# Altium schematic sheet comms_uhf.SchDoc
size A4; SheetNumber: 2; SheetTotal: 5
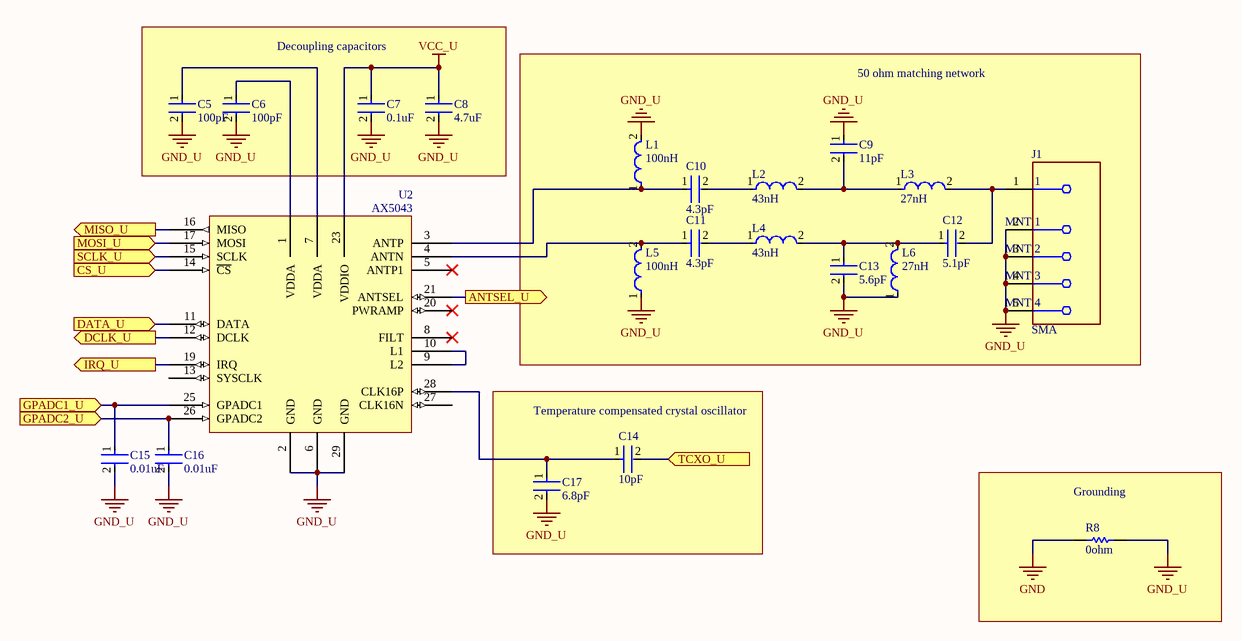
[diagram p0: comms_uhf.SchDoc]

## Parts
C5  100pF  [FP-C0805C-DN-IPC_A]
C6  100pF  [FP-C0805C-DN-IPC_A]
C7  0.1uF  [FP-C0805C-DN-IPC_A]
C8  4.7uF  [FP-C0805C-DN-IPC_A]
C9  11pF  [FP-C0805C-DN-IPC_A]
C10  4.3pF  [FP-C0805C-DN-IPC_A]
C11  4.3pF  [FP-C0805C-DN-IPC_A]
C12  5.1pF  [FP-C0805C-DN-IPC_A]
C13  5.6pF  [FP-C0805C-DN-IPC_A]
C14  10pF  [FP-C0805C-DN-IPC_A]
C15  0.01uF  [FP-C0805C-DN-IPC_A]
C16  0.01uF  [FP-C0805C-DN-IPC_A]
C17  6.8pF  [FP-C0805C-DN-IPC_A]
J1  SMA  [FP-73251-1350-MFG]
L1  100nH  [FP-C0805C-DN-IPC_A]
L2  43nH  [FP-C0805C-DN-IPC_A]
L3  27nH  [FP-C0805C-DN-IPC_A]
L4  43nH  [FP-C0805C-DN-IPC_A]
L5  100nH  [FP-C0805C-DN-IPC_A]
L6  27nH  [FP-C0805C-DN-IPC_A]
R8  0ohm  [FP-C0805C-DN-IPC_A]
U2  AX5043  [QFN50P500X500X90_HS-29N]

## Blocks framed on the sheet
Decoupling capacitors: C5-C8
50 ohm matching network: C9-C13 J1 L1-L6
Temperature compensated crystal oscillator: C14 C17
Grounding: R8

## Ports
ANTSEL_U (out), CS_U (in), DATA_U (in), DCLK_U (out), GPADC1_U (in), GPADC2_U (in), IRQ_U (out), MISO_U (out), MOSI_U (in), SCLK_U (in), TCXO_U (in)

## Nets
GND: R8.1
GND_U: C5.2 C6.2 C7.2 C8.2 C9.1 C13.2 C15.2 C16.2 C17.2 J1.2(MNT_1) J1.3(MNT_2) J1.4(MNT_3) J1.5(MNT_4) L1.2 L5.1 L6.1 R8.2 U2.2(GND) U2.6(GND) U2.29(GND)
VCC_U: C7.1 C8.1 U2.23(VDDIO)
ANTSEL_U: U2.21(ANTSEL) ; port ANTSEL_U
CS_U: U2.14(~{CS}) ; port CS_U
DATA_U: U2.11(DATA) ; port DATA_U
DCLK_U: U2.12(DCLK) ; port DCLK_U
GPADC1_U: C15.1 U2.25(GPADC1) ; port GPADC1_U
GPADC2_U: C16.1 U2.26(GPADC2) ; port GPADC2_U
IRQ_U: U2.19(IRQ) ; port IRQ_U
MISO_U: U2.16(MISO) ; port MISO_U
MOSI_U: U2.17(MOSI) ; port MOSI_U
SCLK_U: U2.15(SCLK) ; port SCLK_U
TCXO_U: C14.2 ; port TCXO_U
NetC5_1: C5.1 U2.7(VDDA)
NetC6_1: C6.1 U2.1(VDDA)
NetC9_2: C9.2 L2.2 L3.1
NetC10_1: C10.1 L1.1 U2.3(ANTP)
NetC10_2: C10.2 L2.1
NetC11_1: C11.1 L5.2 U2.4(ANTN)
NetC11_2: C11.2 L4.1
NetC12_1: C12.1 C13.1 L4.2 L6.2
NetC12_2: C12.2 J1.1 L3.2
NetC14_1: C14.1 C17.1 U2.28(CLK16P)
NetU2_9: U2.9(L2) U2.10(L1)

Not connected (* = marked no-connect by the designer): U2 5(ANTP1)* 8(FILT)* 13(SYSCLK) 20(PWRAMP)* 27(CLK16N)

## Library data of the parts
C5 C6 = C0805C101J1GACTU: Multilayer Ceramic Capacitors (MLCC) - SMD/SMT 100volts 100pF C0G 5%; Manufacturer: KEMET; Voltage Rating: 100V; Temperature Coefficient: 30ppm/°C; Dissipation Factor: 0.1%; Supplier 1: Digi-Key; Manufacturer Part Number: C0805C101J1GACTU; RoHS: Yes; Category: Ceramic Capacitors; Stock 1: 41207; Pricing 1: 1=0.11000, 10=0.07900, 50=0.04500, 100=0.03730, 500=0.02616, 1000=0.02166 (USD); Mount: Surface Mount,PCB; Case/Package: 0805; Number of Pins: 2; Case Code (Imperial): 0805; Case Code (Metric): 2012; Contact Plating: Tin,Matte; Dielectric Material: Ceramic; Contact Material: Tin; Min Operating Temperature: -55°C; Max Operating Temperature: 125°C; Capacitance: 100pF; Tolerance: 5%; Voltage Rating (DC): 100V; Packaging: Tape and Reel; Dielectric: C0G; Series: C; Package Quantity: 1; Termination: SMD/SMT; Voltage: 100V; Construction: Flat; Length: 2mm; Width: 1.2mm; Height: 0.78mm; Thickness: 0.035inch; Depth: 1.25mm; Lead Pitch: 0.75mm; Radiation Hardening: No; Lead Free: Lead Free; RoHS Compliant: Yes; REACH SVHC: No SVHC; ComponentLink1URL: https://datasheet.ciiva.com/144/docfinderpartnumber-c0805c101j1gactu-144890.pdf?src-supplier=Digi-Key; ComponentLink1Description: https://datasheet.ciiva.com/144/docfinderpartnumber-c0805c101j1gactu-144890.pdf?src-supplier=Digi-Key; ComponentLink2URL: https://datasheet.ciiva.com/6126/f9080b-0402-series-c0g-6126695.pdf?src-supplier=Farnell; ComponentLink2Description: https://datasheet.ciiva.com/6126/f9080b-0402-series-c0g-6126695.pdf?src-supplier=Farnell; ComponentLink3URL: https://datasheet.ciiva.com/2988/kem-c1003-c0g-smd-2988557.pdf?src-supplier=Avnet; ComponentLink3Description: https://datasheet.ciiva.com/2988/kem-c1003-c0g-smd-2988557.pdf?src-supplier=Avnet; ComponentLink4URL: https://datasheet.ciiva.com/2988/kem-c1003-c0g-smd-2988558.pdf?src-supplier=Avnet; ComponentLink4Description: https://datasheet.ciiva.com/2988/kem-c1003-c0g-smd-2988558.pdf?src-supplier=Avnet; ComponentLink5URL: https://datasheet.ciiva.com/14589/70095383-14589484.pdf?src-supplier=Allied+Electronics; ComponentLink5Description: https://datasheet.ciiva.com/14589/70095383-14589484.pdf?src-supplier=Allied+Electronics; ComponentLink6URL: https://datasheet.ciiva.com/14591/70095383-14591851.pdf?src-supplier=Allied+Electronics; ComponentLink6Description: https://datasheet.ciiva.com/14591/70095383-14591851.pdf?src-supplier=Allied+Electronics; ComponentLink7URL: https://datasheet.ciiva.com/7842/40889-7842143.pdf?src-supplier=Element14; ComponentLink7Description: https://datasheet.ciiva.com/7842/40889-7842143.pdf?src-supplier=Element14; ComponentLink8URL: https://datasheet.ciiva.com/28688/1789732-28688663.pdf?src-supplier=Element14; ComponentLink8Description: https://datasheet.ciiva.com/28688/1789732-28688663.pdf?src-supplier=Element14; ComponentLink9URL: https://datasheet.ciiva.com/18193/getdatasheetpartid-93983-18193285.pdf?src-supplier=Verical; ComponentLink9Description: https://datasheet.ciiva.com/18193/getdatasheetpartid-93983-18193285.pdf?src-supplier=Verical; ComponentLink10URL: https://datasheet.ciiva.com/7405/1372242-7405224.pdf?src-supplier=Newark; ComponentLink10Description: https://datasheet.ciiva.com/7405/1372242-7405224.pdf?src-supplier=Newark; Supplier Part Number 1: 399-C0805C101J1GAC7800CT-ND
C7 = C0805C104K5RACTU: Cap Ceramic 0.1uF 50V X7R 10% SMD 2.0 x 1.2 mm 125 C Paper T/R; Manufacturer: KEMET; Capacitance: 100nF; Voltage: 500V; Supplier 1: Digi-Key; Manufacturer Part Number: C0805C104K5RACTU; RoHS: Yes; Category: Ceramic Capacitors; Pricing 1: 1=0.15000, 10=0.10500, 50=0.05960, 100=0.04940, 500=0.03466, 1000=0.02869 (USD); Mount: Surface Mount,PCB; Case/Package: 0805; Number of Pins: 2; Case Code (Imperial): 0805; Case Code (Metric): 2012; Dielectric Material: Ceramic; Contact Plating: Tin,Matte; Min Operating Temperature: -55°C; Max Operating Temperature: 125°C; Package Quantity: 4000; Voltage Rating: 50V; Tolerance: 10%; Packaging: Tape and Reel; Dielectric: X7R; Termination: SMD/SMT; Voltage Rating (DC): 50V; Series: C0805C; Construction: Flat; Length: 2mm; Width: 1.2mm; Height: 0.9mm; Thickness: 0.035inch; Depth: 1.25mm; Lead Pitch: 0.75mm; Radiation Hardening: No; REACH SVHC: No SVHC; RoHS Compliant: Yes; ComponentLink1URL: https://www.distrelec.biz/Web/Downloads/_t/ds/KEM_C1002_X7R_SMD_eng_tds.pdf?mime=application%2Fpdf&src-supplier=Distrelec; ComponentLink1Description: https://www.distrelec.biz/Web/Downloads/_t/ds/KEM_C1002_X7R_SMD_eng_tds.pdf?mime=application%2Fpdf&src-supplier=Distrelec; ComponentLink2URL: http://www.farnell.com/datasheets/2740684.pdf?src-supplier=Farnell; ComponentLink2Description: http://www.farnell.com/datasheets/2740684.pdf?src-supplier=Farnell; ComponentLink3URL: http://www.farnell.com/datasheets/2740684.pdf?src-supplier=Element14; ComponentLink3Description: http://www.farnell.com/datasheets/2740684.pdf?src-supplier=Element14; Supplier Part Number 1: 399-C0805C104K5RAC7800CT-ND; Stock 1: 2034176
C8 = C0805C475K3PACTU: Cap Ceramic 4.7uF 25V X5R 10% SMD 0805 85°C Plastic T/R; Manufacturer: KEMET; Dissipation Factor: 5%; Supplier 1: Digi-Key; Manufacturer Part Number: C0805C475K3PACTU; RoHS: Yes; Category: Ceramic Capacitors; Pricing 1: 1=0.36000, 10=0.24800, 50=0.16500, 100=0.14020, 500=0.09900, 1000=0.08662 (USD); Mount: PCB,Surface Mount; Case/Package: 0805; Number of Pins: 2; Case Code (Imperial): 0805; Case Code (Metric): 2012; Dielectric Material: Ceramic; Contact Plating: Tin,Matte; Min Operating Temperature: -55°C; Max Operating Temperature: 85°C; Capacitance: 4.7uF; Tolerance: 10%; Packaging: Tape and Reel; Dielectric: X5R; Package Quantity: 2500; Series: C0805C; Termination: SMD/SMT; Voltage Rating (DC): 25V; Construction: Flat; Voltage: 25V; Length: 2mm; Width: 1.2mm; Height: 1.25mm; Depth: 1.25mm; Radiation Hardening: No; RoHS Compliant: Yes; Lead Free: Lead Free; REACH SVHC: No SVHC; ComponentLink1URL: https://datasheet.ciiva.com/3776/c0603c102k5racturegion-naregion-na-3776917.pdf?src-supplier=Arrow+Electronics; ComponentLink1Description: https://datasheet.ciiva.com/3776/c0603c102k5racturegion-naregion-na-3776917.pdf?src-supplier=Arrow+Electronics; ComponentLink2URL: https://datasheet.ciiva.com/18193/getdatasheetpartid-385757-18193895.pdf?src-supplier=Verical; ComponentLink2Description: https://datasheet.ciiva.com/18193/getdatasheetpartid-385757-18193895.pdf?src-supplier=Verical; ComponentLink3URL: https://datasheet.ciiva.com/18193/getdatasheetpartid-195812-18193898.pdf?src-supplier=Verical; ComponentLink3Description: https://datasheet.ciiva.com/18193/getdatasheetpartid-195812-18193898.pdf?src-supplier=Verical; ComponentLink4URL: https://datasheet.ciiva.com/7842/40889-7842614.pdf?src-supplier=Element14; ComponentLink4Description: https://datasheet.ciiva.com/7842/40889-7842614.pdf?src-supplier=Element14; ComponentLink5URL: https://datasheet.ciiva.com/22748/1918694-22748309.pdf?src-supplier=Element14; ComponentLink5Description: https://datasheet.ciiva.com/22748/1918694-22748309.pdf?src-supplier=Element14; Supplier Part Number 1: 399-C0805C475K3PAC7800CT-ND; Stock 1: 10860
C9 = C0805C110J5GACTU: Cap Ceramic 11pF 50V C0G 5% SMD 0805 125°C Plastic T/R; Manufacturer: KEMET; Dissipation Factor: 0.1%; Supplier 1: Digi-Key; Manufacturer Part Number: C0805C110J5GACTU; RoHS: Yes; Category: Ceramic Capacitors; Mount: Surface Mount; Case/Package: 0805; Case Code (Metric): 2012; Case Code (Imperial): 0805; Dielectric Material: Ceramic; Min Operating Temperature: -55°C; Max Operating Temperature: 125°C; Package Quantity: 1; Capacitance: 11pF; Tolerance: 5%; Packaging: Tape and Reel; Voltage Rating: 50V; Series: C; Voltage Rating (DC): 50V; Termination: SMD/SMT; Dielectric: C0G; Length: 0.079inch; Width: 0.049inch; Height: 0.78mm; Thickness: 0.035inch; Lead Pitch: 0.75mm; RoHS Compliant: Yes; Lead Free: Lead Free; ComponentLink1URL: https://datasheet.ciiva.com/5424/kem-c1003-c0g-smd-356956-5424409.pdf?src-supplier=Mouser; ComponentLink1Description: https://datasheet.ciiva.com/5424/kem-c1003-c0g-smd-356956-5424409.pdf?src-supplier=Mouser; Supplier Part Number 1: 399-9164-1-ND
C10 C11 = C0805C439D1GACTU: Cap Ceramic 4.3pF 100V C0G 0.5pF SMD 0805 125°C Paper T/R; Manufacturer: KEMET; Supplier 1: Digi-Key; Manufacturer Part Number: C0805C439D1GACTU; RoHS: Yes; Category: Ceramic Capacitors; Mount: Surface Mount; Case/Package: 0805; Case Code (Metric): 2012; Case Code (Imperial): 0805; Weight: 0.000194oz; Dielectric Material: Ceramic; Min Operating Temperature: -55°C; Max Operating Temperature: 125°C; Capacitance: 4.3pF; Package Quantity: 4000; Packaging: Tape and Reel; Voltage Rating (DC): 100V; Dielectric: C0G; Termination: SMD/SMT; Voltage Rating: 100V; Series: C; Length: 2mm; Width: 0.049inch; Height: 0.78mm; Thickness: 0.035inch; Depth: 1.25mm; RoHS Compliant: Yes; Lead Free: Lead Free; ComponentLink1URL: https://datasheet.ciiva.com/5440/kem-c1003-c0g-smd-356956-5440447.pdf?src-supplier=Mouser; ComponentLink1Description: https://datasheet.ciiva.com/5440/kem-c1003-c0g-smd-356956-5440447.pdf?src-supplier=Mouser; Supplier Part Number 1: C0805C439D1GACTU-ND
C12 = C0805C519C5GACTU: Cap Ceramic 5.1pF 50V C0G 0.25pF SMD 0805 125°C Paper T/R; Manufacturer: KEMET; Dissipation Factor: 0.1%; Supplier 1: Digi-Key; Manufacturer Part Number: C0805C519C5GACTU; RoHS: Yes; Category: Ceramic Capacitors; Pricing 1: 4000=0.11781 (USD); Mount: Surface Mount; Case/Package: 0805; Case Code (Imperial): 0805; Case Code (Metric): 2012; Dielectric Material: Ceramic; Min Operating Temperature: -55°C; Max Operating Temperature: 125°C; Capacitance: 5.1pF; Voltage Rating (DC): 50V; Packaging: Tape and Reel; Dielectric: C0G; Package Quantity: 4000; Termination: SMD/SMT; Voltage Rating: 50V; Series: C0805C; Length: 0.079inch; Width: 1.2mm; Thickness: 0.035inch; RoHS Compliant: Yes; Lead Free: Lead Free; REACH SVHC: No SVHC; ComponentLink1URL: http://www.farnell.com/datasheets/2112203.pdf?src-supplier=Farnell; ComponentLink1Description: http://www.farnell.com/datasheets/2112203.pdf?src-supplier=Farnell; ComponentLink2URL: http://www.mouser.com/ds/2/212/KEM_C1003_C0G_SMD-1101588.pdf?src-supplier=Mouser; ComponentLink2Description: http://www.mouser.com/ds/2/212/KEM_C1003_C0G_SMD-1101588.pdf?src-supplier=Mouser; ComponentLink3URL: https://search.kemet.com/component-edge/download/datasheet/C0805C519C5GACTU.pdf?src-supplier=Digi-Key; ComponentLink3Description: https://search.kemet.com/component-edge/download/datasheet/C0805C519C5GACTU.pdf?src-supplier=Digi-Key; ComponentLink4URL: http://www.farnell.com/datasheets/2112203.pdf?src-supplier=Element14; ComponentLink4Description: http://www.farnell.com/datasheets/2112203.pdf?src-supplier=Element14; Supplier Part Number 1: 399-C0805C519C5GAC7800TR-ND
C13 = C0805C569D5GACTU: Cap Ceramic 5.6pF 50V C0G 0.5pF SMD 0805 125°C Plastic T/R; Manufacturer: KEMET; Dissipation Factor: 0.5%; Supplier 1: Digi-Key; Manufacturer Part Number: C0805C569D5GACTU; RoHS: Yes; Category: Ceramic Capacitors; Stock 1: 16697; Pricing 1: 1=0.24000, 10=0.16500, 50=0.11000, 100=0.09350, 500=0.06600, 1000=0.05775 (USD); Mount: Surface Mount; Case/Package: 0805; Case Code (Metric): 2012; Case Code (Imperial): 0805; Dielectric Material: Ceramic; Contact Material: Tin; Min Operating Temperature: -55°C; Max Operating Temperature: 125°C; Capacitance: 5.6pF; Packaging: Tape and Reel; Dielectric: C0G; Package Quantity: 1; Voltage Rating (DC): 50V; Termination: SMD/SMT; Voltage Rating: 50V; Series: C; Length: 2mm; Width: 0.049inch; Height: 0.78mm; Thickness: 0.035inch; Depth: 1.25mm; Lead Pitch: 0.75mm; RoHS Compliant: Yes; Lead Free: Lead Free; REACH SVHC: No SVHC; ComponentLink1URL: https://www.distrelec.biz/Web/Downloads/_t/ds/KEM_C1003_C0G_SMD_eng_tds.pdf?mime=application%2Fpdf&src-supplier=Distrelec; ComponentLink1Description: https://www.distrelec.biz/Web/Downloads/_t/ds/KEM_C1003_C0G_SMD_eng_tds.pdf?mime=application%2Fpdf&src-supplier=Distrelec; ComponentLink2URL: http://www.mouser.com/ds/2/212/KEM_C1003_C0G_SMD-1101588.pdf?src-supplier=Mouser; ComponentLink2Description: http://www.mouser.com/ds/2/212/KEM_C1003_C0G_SMD-1101588.pdf?src-supplier=Mouser; ComponentLink3URL: https://api.kemet.com/component-edge/download/datasheet/C0805C569D5GACTU.pdf?src-supplier=Digi-Key; ComponentLink3Description: https://api.kemet.com/component-edge/download/datasheet/C0805C569D5GACTU.pdf?src-supplier=Digi-Key; ComponentLink4URL: https://search.kemet.com/component-edge/download/datasheet/C0805C569D5GACTU.pdf?src-supplier=Digi-Key; ComponentLink4Description: https://search.kemet.com/component-edge/download/datasheet/C0805C569D5GACTU.pdf?src-supplier=Digi-Key; Supplier Part Number 1: 399-C0805C569D5GAC7800CT-ND
C14 = C0805C100J1GACTU: Cap Ceramic 10pF 100V C0G 5% SMD 0805 125C Plastic T/R; Manufacturer: KEMET; Dissipation Factor: 0.1%; Temperature Coefficient: 30ppm/°C; Supplier 1: Digi-Key; Manufacturer Part Number: C0805C100J1GACTU; RoHS: Yes; Category: Ceramic Capacitors; Stock 1: 26087; Pricing 1: 1=0.20000, 10=0.14000, 50=0.07960, 100=0.06600, 500=0.04630, 1000=0.03833 (USD); Mount: Surface Mount,PCB; Case/Package: 0805; Number of Pins: 2; Case Code (Metric): 2012; Case Code (Imperial): 0805; Dielectric Material: Ceramic; Weight: 0.000194oz; Contact Material: Tin; Min Operating Temperature: -55°C; Max Operating Temperature: 125°C; Capacitance: 10pF; Packaging: Tape and Reel; Voltage Rating: 100V; Voltage Rating (DC): 100V; Package Quantity: 1; Dielectric: C0G; Termination: SMD/SMT; Tolerance: 5%; Series: C; Construction: Flat; Voltage: 100V; Length: 2mm; Width: 0.049inch; Height: 0.78mm; Thickness: 0.035inch; Depth: 1.25mm; Radiation Hardening: No; REACH SVHC: No SVHC; RoHS Compliant: Yes; Lead Free: Lead Free; ComponentLink1URL: https://datasheet.ciiva.com/7842/kem-c1003-c0g-smd-7842137.pdf?src-supplier=Element14; ComponentLink1Description: https://datasheet.ciiva.com/7842/kem-c1003-c0g-smd-7842137.pdf?src-supplier=Element14; ComponentLink2URL: https://datasheet.ciiva.com/7842/kem-c1003-c0g-smd-7842136.pdf?src-supplier=Element14; ComponentLink2Description: https://datasheet.ciiva.com/7842/kem-c1003-c0g-smd-7842136.pdf?src-supplier=Element14; ComponentLink3URL: https://datasheet.ciiva.com/28668/1789732-28668725.pdf?src-supplier=Element14; ComponentLink3Description: https://datasheet.ciiva.com/28668/1789732-28668725.pdf?src-supplier=Element14; ComponentLink4URL: https://datasheet.ciiva.com/14588/70095383-14588189.pdf?src-supplier=Allied+Electronics; ComponentLink4Description: https://datasheet.ciiva.com/14588/70095383-14588189.pdf?src-supplier=Allied+Electronics; ComponentLink5URL: https://datasheet.ciiva.com/14603/70095383-14603133.pdf?src-supplier=Allied+Electronics; ComponentLink5Description: https://datasheet.ciiva.com/14603/70095383-14603133.pdf?src-supplier=Allied+Electronics; Supplier Part Number 1: 399-C0805C100J1GAC7800CT-ND
C15 C16 = C0805C103K5RAC-TU: Cap Ceramic 0.01uF 50V X7R 10% SMD 0805 125C Plastic T/R; Manufacturer: KEMET; Capacitance: 10nF; Supplier 1: RSComponents; Manufacturer Part Number: C0805C103K5RAC-TU; RoHS: Yes; Category: Ceramic Capacitors; Stock 1: 8800; Pricing 1: 25=0.14500, 100=0.13600, 250=0.12500, 500=0.11800, 1250=0.10800 (USD); Mount: PCB,Surface Mount; Case/Package: 0805; Number of Pins: 2; Case Code (Metric): 2012; Case Code (Imperial): 0805; Dielectric Material: Ceramic; Min Operating Temperature: -55°C; Max Operating Temperature: 125°C; Voltage Rating (DC): 50V; Tolerance: 10%; Voltage Rating: 50V; Packaging: Tape and Reel; Package Quantity: 4000; Dielectric: X7R; Termination: SMD/SMT; Voltage: 50V; Series: C0805C; Construction: Flat; Length: 2mm; Width: 1.2mm; Height: 0.78mm; Thickness: 0.035inch; Depth: 1.25mm; Lead Pitch: 0.75mm; Radiation Hardening: No; REACH SVHC: No SVHC; ComponentLink1URL: https://datasheet.ciiva.com/7172/1828800-7172412.pdf?src-supplier=Newark; ComponentLink1Description: https://datasheet.ciiva.com/7172/1828800-7172412.pdf?src-supplier=Newark; ComponentLink2URL: https://datasheet.ciiva.com/5904/kem-c1002-x7r-smd-5904709.pdf?src-supplier=Farnell; ComponentLink2Description: https://datasheet.ciiva.com/5904/kem-c1002-x7r-smd-5904709.pdf?src-supplier=Farnell; ComponentLink3URL: https://datasheet.ciiva.com/7842/kem-c1002-x7r-smd-7842533.pdf?src-supplier=Element14; ComponentLink3Description: https://datasheet.ciiva.com/7842/kem-c1002-x7r-smd-7842533.pdf?src-supplier=Element14; ComponentLink4URL: https://datasheet.ciiva.com/28672/1851736-28672830.pdf?src-supplier=Element14; ComponentLink4Description: https://datasheet.ciiva.com/28672/1851736-28672830.pdf?src-supplier=Element14; ComponentLink5URL: https://datasheet.ciiva.com/26923/getdatasheetpartid-759674-26923957.pdf?src-supplier=Verical; ComponentLink5Description: https://datasheet.ciiva.com/26923/getdatasheetpartid-759674-26923957.pdf?src-supplier=Verical; ComponentLink6URL: https://datasheet.ciiva.com/39122/docfinderpartnumberc0402c102k5ractu-39122923.pdf?src-supplier=Onlinecomponents.com; ComponentLink6Description: https://datasheet.ciiva.com/39122/docfinderpartnumberc0402c102k5ractu-39122923.pdf?src-supplier=Onlinecomponents.com; Supplier Part Number 1: 2644371
C17 = C0805C689D5GACTU: Cap Ceramic 6.8pF 50V C0G 0.5pF SMD 0805 125°C Plastic T/R; Manufacturer: KEMET; Dissipation Factor: 0.1%; Supplier 1: Digi-Key; Manufacturer Part Number: C0805C689D5GACTU; RoHS: Yes; Category: Ceramic Capacitors; Stock 1: 43898; Pricing 1: 1=0.24000, 10=0.16500, 50=0.11000, 100=0.09350, 500=0.06600, 1000=0.05775 (USD); Mount: Surface Mount; Case/Package: 0805; Case Code (Metric): 2012; Case Code (Imperial): 0805; Dielectric Material: Ceramic; Contact Material: Tin; Min Operating Temperature: -55°C; Max Operating Temperature: 125°C; Package Quantity: 1; Capacitance: 6.8pF; Voltage Rating: 50V; Packaging: Tape and Reel; Voltage Rating (DC): 50V; Termination: SMD/SMT; Series: C; Dielectric: C0G; Construction: Flat; Length: 2mm; Width: 0.049inch; Height: 0.78mm; Thickness: 0.035inch; Depth: 1.25mm; Lead Pitch: 0.75mm; Radiation Hardening: No; RoHS Compliant: Yes; Lead Free: Lead Free; REACH SVHC: No SVHC; ComponentLink1URL: https://www.distrelec.biz/Web/Downloads/_t/ds/KEM_C1003_C0G_SMD_eng_tds.pdf?mime=application%2Fpdf&src-supplier=Distrelec; ComponentLink1Description: https://www.distrelec.biz/Web/Downloads/_t/ds/KEM_C1003_C0G_SMD_eng_tds.pdf?mime=application%2Fpdf&src-supplier=Distrelec; ComponentLink2URL: http://www.farnell.com/datasheets/2330629.pdf?src-supplier=Farnell; ComponentLink2Description: http://www.farnell.com/datasheets/2330629.pdf?src-supplier=Farnell; ComponentLink3URL: http://www.mouser.com/ds/2/212/KEM_C1003_C0G_SMD-1101588.pdf?src-supplier=Mouser; ComponentLink3Description: http://www.mouser.com/ds/2/212/KEM_C1003_C0G_SMD-1101588.pdf?src-supplier=Mouser; ComponentLink4URL: http://www.farnell.com/datasheets/2330629.pdf?src-supplier=Newark; ComponentLink4Description: http://www.farnell.com/datasheets/2330629.pdf?src-supplier=Newark; ComponentLink5URL: https://api.kemet.com/component-edge/download/datasheet/C0805C689D5GACTU.pdf?src-supplier=Digi-Key; ComponentLink5Description: https://api.kemet.com/component-edge/download/datasheet/C0805C689D5GACTU.pdf?src-supplier=Digi-Key; ComponentLink6URL: https://search.kemet.com/component-edge/download/datasheet/C0805C689D5GACTU.pdf?src-supplier=Digi-Key; ComponentLink6Description: https://search.kemet.com/component-edge/download/datasheet/C0805C689D5GACTU.pdf?src-supplier=Digi-Key; Supplier Part Number 1: 399-C0805C689D5GAC7800CT-ND
J1 = 73251-1350: RF Connectors / Coaxial Connectors SMA ST PCB-JCK STD SMT; Manufacturer: Molex; Body Material: Brass; Body Plating: Gold; Impedance: 50R; Connector Type: SMA,Coaxial; Gender: Female; Supplier 1: Digi-Key; Manufacturer Part Number: 73251-1350; RoHS: Yes; Category: RF / Coaxial Connectors; Pricing 1: 1=3.73000, 10=3.28200, 80=2.61025, 1600=2.08824 (USD); Case/Package: SMA; Contact Material: Copper; Contact Plating: Gold; Insulation Material: Teflon; Packaging: Tray; Termination: Solder; Package Quantity: 1600; Series: 73251; Orientation: Straight; Length: 6.35mm; Depth: 6.35mm; Radiation Hardening: No; RoHS Compliant: Yes; REACH SVHC: Unknown; Halogen Free: Low Halogen; ComponentLink1URL: https://datasheet.ciiva.com/22652/1443748-22652884.pdf?src-supplier=Element14; ComponentLink1Description: https://datasheet.ciiva.com/22652/1443748-22652884.pdf?src-supplier=Element14; ComponentLink2URL: https://datasheet.ciiva.com/5718/1716114-5718582.pdf?src-supplier=Farnell; ComponentLink2Description: https://datasheet.ciiva.com/5718/1716114-5718582.pdf?src-supplier=Farnell; ComponentLink3URL: https://datasheet.ciiva.com/7996/1818909-7996462.pdf?src-supplier=Element14; ComponentLink3Description: https://datasheet.ciiva.com/7996/1818909-7996462.pdf?src-supplier=Element14; ComponentLink4URL: https://datasheet.ciiva.com/23673/1763868-23673641.pdf?src-supplier=Newark; ComponentLink4Description: https://datasheet.ciiva.com/23673/1763868-23673641.pdf?src-supplier=Newark; ComponentLink5URL: https://datasheet.ciiva.com/15226/getdatasheetpartid-152891-15226055.pdf?src-supplier=Verical; ComponentLink5Description: https://datasheet.ciiva.com/15226/getdatasheetpartid-152891-15226055.pdf?src-supplier=Verical; Supplier Part Number 1: WM9357-ND
L1 L5 = LQW2BASR10J00L: Ind RF Chip Wirewound 100nH 5% 150MHz 65Q-Factor 400mA 0805 Embossed T/R; Manufacturer: Murata; Core Material: Air; Shielding: Unshielded; DC Resistance (DCR): 460mR; Self Resonant Frequency: 1.25GHz; Q Factor: 65; Supplier 1: Digi-Key; Manufacturer Part Number: LQW2BASR10J00L; RoHS: Yes; Category: Fixed Inductors; Stock 1: 1394; Pricing 1: 1=0.25000, 10=0.22800, 25=0.20240, 50=0.17200, 100=0.15180, 250=0.13916, 500=0.12650, 1000=0.10626 (USD); Mount: Surface Mount; Case/Package: 0805; Case Code (Metric): 2015; Case Code (Imperial): 0806; Weight: 0.000494oz; Min Operating Temperature: -55°C; Max Operating Temperature: 125°C; Tolerance: 5%; Packaging: Tape and Reel; Inductance: 100nH; Test Frequency: 150MHz; Package Quantity: 2000; Current Rating: 400mA; Max DC Current: 400mA; Series: LQW2BA; Termination: SMD/SMT; Resistor Type: Wirewound; Length: 0.082inch; Width: 1.5mm; Height: 1.42mm; Height - Seated (Max): 0.06inch; Depth: 1.73mm; Radiation Hardening: No; RoHS Compliant: Yes; ComponentLink1URL: https://datasheet.ciiva.com/4975/l0075s0080lqw2ba-125197-4975968.pdf?src-supplier=Mouser; ComponentLink1Description: https://datasheet.ciiva.com/4975/l0075s0080lqw2ba-125197-4975968.pdf?src-supplier=Mouser; ComponentLink2URL: https://datasheet.ciiva.com/1044/l0075s0080lqw2ba-1044724.pdf?src-supplier=Digi-Key; ComponentLink2Description: https://datasheet.ciiva.com/1044/l0075s0080lqw2ba-1044724.pdf?src-supplier=Digi-Key; ComponentLink3URL: https://datasheet.ciiva.com/1044/l0075s0080lqw2ba-1044725.pdf?src-supplier=Digi-Key; ComponentLink3Description: https://datasheet.ciiva.com/1044/l0075s0080lqw2ba-1044725.pdf?src-supplier=Digi-Key; ComponentLink4URL: https://datasheet.ciiva.com/1044/l0075s0080lqw2ba-1044726.pdf?src-supplier=Digi-Key; ComponentLink4Description: https://datasheet.ciiva.com/1044/l0075s0080lqw2ba-1044726.pdf?src-supplier=Digi-Key; ComponentLink5URL: https://datasheet.ciiva.com/3080/l0075s0080lqw2ba-3080333.pdf?src-supplier=Avnet; ComponentLink5Description: https://datasheet.ciiva.com/3080/l0075s0080lqw2ba-3080333.pdf?src-supplier=Avnet; Supplier Part Number 1: 490-5664-1-ND
L2 L4 = LQW2BAS43NJ00L: Ind RF Chip Wirewound 43nH 5% 200MHz 60Q-Factor 500mA 0805 Embossed T/R; Manufacturer: Murata; Core Material: Air; Self Resonant Frequency: 1.8GHz; DC Resistance (DCR): 340mR; Q Factor: 60; Shielding: Unshielded; Supplier 1: Digi-Key; Manufacturer Part Number: LQW2BAS43NJ00L; RoHS: Yes; Category: Fixed Inductors; Stock 1: 3838; Pricing 1: 1=0.25000, 10=0.22800, 25=0.20240, 50=0.17200, 100=0.15180, 250=0.13916, 500=0.12650, 1000=0.10626 (USD); Mount: Surface Mount; Case/Package: 0805; Weight: 0.000494oz; Case Code (Metric): 2015; Case Code (Imperial): 0805; Min Operating Temperature: -55°C; Max Operating Temperature: 125°C; Packaging: Tape and Reel; Inductance: 43nH; Tolerance: 5%; Series: LQW2BA; Current Rating: 500mA; Test Frequency: 200MHz; Max DC Current: 500mA; Package Quantity: 2000; Termination: SMD/SMT; Resistor Type: Wirewound; DC Current: 500mA; Length: 0.082inch; Width: 0.06inch; Height: 1.42mm; Height - Seated (Max): 0.06inch; Depth: 1.73mm; Radiation Hardening: No; RoHS Compliant: Yes; Military Standard: Not; ComponentLink1URL: https://datasheet.ciiva.com/1044/l0075s0080lqw2ba-1044718.pdf?src-supplier=Digi-Key; ComponentLink1Description: https://datasheet.ciiva.com/1044/l0075s0080lqw2ba-1044718.pdf?src-supplier=Digi-Key; ComponentLink2URL: https://datasheet.ciiva.com/1044/l0075s0080lqw2ba-1044719.pdf?src-supplier=Digi-Key; ComponentLink2Description: https://datasheet.ciiva.com/1044/l0075s0080lqw2ba-1044719.pdf?src-supplier=Digi-Key; ComponentLink3URL: https://datasheet.ciiva.com/1044/l0075s0080lqw2ba-1044720.pdf?src-supplier=Digi-Key; ComponentLink3Description: https://datasheet.ciiva.com/1044/l0075s0080lqw2ba-1044720.pdf?src-supplier=Digi-Key; ComponentLink4URL: https://datasheet.ciiva.com/3080/l0075s0080lqw2ba-3080323.pdf?src-supplier=Avnet; ComponentLink4Description: https://datasheet.ciiva.com/3080/l0075s0080lqw2ba-3080323.pdf?src-supplier=Avnet; Supplier Part Number 1: 490-5658-1-ND
L3 L6 = LQW2BAS27NJ00L: Ind RF Chip Wirewound 27nH 0.5A ±5% 0805; Manufacturer: Murata; Core Material: Air,Non-Magnetic; Self Resonant Frequency: 2.58GHz; Current Rating: 500mA; DC Resistance (DCR): 250mR; Test Frequency: 250MHz; Q Factor: 55; Shielding: Unshielded; Supplier 1: Digi-Key; Manufacturer Part Number: LQW2BAS27NJ00L; RoHS: Yes; Category: Fixed Inductors; Stock 1: 2095; Pricing 1: 1=0.25000, 10=0.22800, 25=0.20240, 50=0.17200, 100=0.15180, 250=0.13916, 500=0.12650, 1000=0.10626 (USD); Mount: Surface Mount; Case/Package: 0805; Case Code (Metric): 2015; Case Code (Imperial): 0806; Weight: 0.000494oz; Min Operating Temperature: -55°C; Max Operating Temperature: 125°C; Packaging: Tape and Reel; Inductance: 27nH; Max DC Current: 500mA; Series: LQW; Tolerance: 5%; Package Quantity: 2000; Termination: SMD/SMT; Resistor Type: Wirewound; DC Current: 500mA; Length: 0.082inch; Width: 1.5mm; Height: 1.42mm; Depth: 1.73mm; Height - Seated (Max): 0.06inch; Radiation Hardening: No; Military Standard: Not; RoHS Compliant: Yes; ComponentLink1URL: https://datasheet.ciiva.com/1044/l0075s0080lqw2ba-1044713.pdf?src-supplier=Digi-Key; ComponentLink1Description: https://datasheet.ciiva.com/1044/l0075s0080lqw2ba-1044713.pdf?src-supplier=Digi-Key; ComponentLink2URL: https://datasheet.ciiva.com/1044/l0075s0080lqw2ba-1044712.pdf?src-supplier=Digi-Key; ComponentLink2Description: https://datasheet.ciiva.com/1044/l0075s0080lqw2ba-1044712.pdf?src-supplier=Digi-Key; ComponentLink3URL: https://datasheet.ciiva.com/1044/l0075s0080lqw2ba-1044714.pdf?src-supplier=Digi-Key; ComponentLink3Description: https://datasheet.ciiva.com/1044/l0075s0080lqw2ba-1044714.pdf?src-supplier=Digi-Key; ComponentLink4URL: https://datasheet.ciiva.com/3080/l0075s0080lqw2ba-3080317.pdf?src-supplier=Avnet; ComponentLink4Description: https://datasheet.ciiva.com/3080/l0075s0080lqw2ba-3080317.pdf?src-supplier=Avnet; Supplier Part Number 1: 490-5654-1-ND
R8 = CRCW08050000Z0EA: CRCW Series 0805 0.125 W 0 Ohm Jumper Surface Mount Thick Film Chip Resistor; Manufacturer: Vishay; Power Rating: 125mW; Temperature Coefficient: 100ppm/°C; Voltage Rating: 150V; Tolerance: 1%; Resistance: 0mR; Supplier 1: Digi-Key; Manufacturer Part Number: CRCW08050000Z0EA; RoHS: Yes; Category: Chip SMD Resistors; Pricing 1: 1=0.10000, 10=0.04400, 25=0.03160, 50=0.02400, 100=0.01770, 250=0.01352, 500=0.01080, 1000=0.00795 (USD); Case/Package: 0805; Case Code (Imperial): 0805; Case Code (Metric): 2012; Contact Plating: Tin,Lead; Size Code: 0805; Weight: 0.000194oz; Min Operating Temperature: -55°C; Max Operating Temperature: 155°C; Packaging: Tape and Reel; Resistor Type: Thick Film; Series: CRCW; Termination: SMD/SMT; Package Quantity: 1; Number of Terminations: 2; Max Power Dissipation: 125mW; Construction: Rectangular; Voltage Rating (DC): 150V; Features: Automotive AEC-Q200; Technology: THICK FILM; Resistance Tolerance: 1%; Length: 2mm; Width: 1.25mm; Height: 0.45mm; Depth: 1.25mm; Radiation Hardening: No; RoHS Compliant: Yes; REACH SVHC: Unknown; Lead Free: Lead Free; Military Standard: Not; ComponentLink1URL: https://datasheet.ciiva.com/11811/0900766b80d98b26-11811304.pdf?src-supplier=RSComponents; ComponentLink1Description: https://datasheet.ciiva.com/11811/0900766b80d98b26-11811304.pdf?src-supplier=RSComponents; ComponentLink2URL: https://datasheet.ciiva.com/2463/dcrcwe3-2463037.pdf?src-supplier=Digi-Key; ComponentLink2Description: https://datasheet.ciiva.com/2463/dcrcwe3-2463037.pdf?src-supplier=Digi-Key; ComponentLink3URL: https://datasheet.ciiva.com/2463/dcrcwe3-2463038.pdf?src-supplier=Digi-Key; ComponentLink3Description: https://datasheet.ciiva.com/2463/dcrcwe3-2463038.pdf?src-supplier=Digi-Key; ComponentLink4URL: https://datasheet.ciiva.com/2463/dcrcwe3-2463039.pdf?src-supplier=Digi-Key; ComponentLink4Description: https://datasheet.ciiva.com/2463/dcrcwe3-2463039.pdf?src-supplier=Digi-Key; ComponentLink5URL: https://datasheet.ciiva.com/5543/dcrcwe3-109170-5543096.pdf?src-supplier=Mouser; ComponentLink5Description: https://datasheet.ciiva.com/5543/dcrcwe3-109170-5543096.pdf?src-supplier=Mouser; ComponentLink6URL: https://datasheet.ciiva.com/16389/dcrcwe3-16389338.pdf?src-supplier=Future+Electronics; ComponentLink6Description: https://datasheet.ciiva.com/16389/dcrcwe3-16389338.pdf?src-supplier=Future+Electronics; ComponentLink7URL: https://datasheet.ciiva.com/7841/1697337-7841629.pdf?src-supplier=Element14; ComponentLink7Description: https://datasheet.ciiva.com/7841/1697337-7841629.pdf?src-supplier=Element14; ComponentLink8URL: https://datasheet.ciiva.com/7841/1720486-7841839.pdf?src-supplier=Element14; ComponentLink8Description: https://datasheet.ciiva.com/7841/1720486-7841839.pdf?src-supplier=Element14; ComponentLink9URL: https://datasheet.ciiva.com/26314/fld-crcw-e3-data-en-26314630.pdf?src-supplier=Distrelec; ComponentLink9Description: https://datasheet.ciiva.com/26314/fld-crcw-e3-data-en-26314630.pdf?src-supplier=Distrelec; ComponentLink10URL: https://datasheet.ciiva.com/16719/70201119-16719706.pdf?src-supplier=Allied+Electronics; ComponentLink10Description: https://datasheet.ciiva.com/16719/70201119-16719706.pdf?src-supplier=Allied+Electronics; Supplier Part Number 1: 541-0.0ADKR-ND
U2 = AX5043-1-TW30: Rf Transceiver ASK/AFSK/FM/FSK/4-FSK/GFSK/GMSK/MSK/PSK 1.8 V to 3.6V 28-PIN QFN T/r; Manufacturer: ON Semiconductor; Frequency: 27MHz; Data Rate: 125Kbps; Sensitivity: -137dBm; Interface: SPI,UART; Current - Receiving: 11mA; Current - Transmitting: 48mA; Supplier 1: Digi-Key; Manufacturer Part Number: AX5043-1-TW30; RoHS: Yes; Category: RF Receivers, Transceivers; Stock 1: 4719; Pricing 1: 1=3.22000, 10=2.87800, 25=2.59040, 100=2.36020, 250=2.12992, 500=2.01478 (USD); Mount: Surface Mount; Case/Package: QFN; Number of Pins: 28; Contact Plating: Gold; Min Operating Temperature: -40°C; Max Operating Temperature: 85°C; Packaging: Tape and Reel; Operating Supply Voltage: 3.6V; Lead Free: Lead Free; ComponentLink1URL: http://www.mouser.com/ds/2/308/AX5043-D-782042.pdf?src-supplier=Mouser; ComponentLink1Description: http://www.mouser.com/ds/2/308/AX5043-D-782042.pdf?src-supplier=Mouser; ComponentLink2URL: http://www.farnell.com/datasheets/2354976.pdf?src-supplier=Farnell; ComponentLink2Description: http://www.farnell.com/datasheets/2354976.pdf?src-supplier=Farnell; ComponentLink3URL: http://www.onsemi.com/pub_link/Collateral/AX5043-D.PDF?src-supplier=Digi-Key; ComponentLink3Description: http://www.onsemi.com/pub_link/Collateral/AX5043-D.PDF?src-supplier=Digi-Key; ComponentLink4URL: http://www.farnell.com/datasheets/2354976.pdf?src-supplier=Newark; ComponentLink4Description: http://www.farnell.com/datasheets/2354976.pdf?src-supplier=Newark; Supplier Part Number 1: AX5043-1-TW30OSCT-ND